# EAGLE design motherboard (EAGLE 6.5.0)
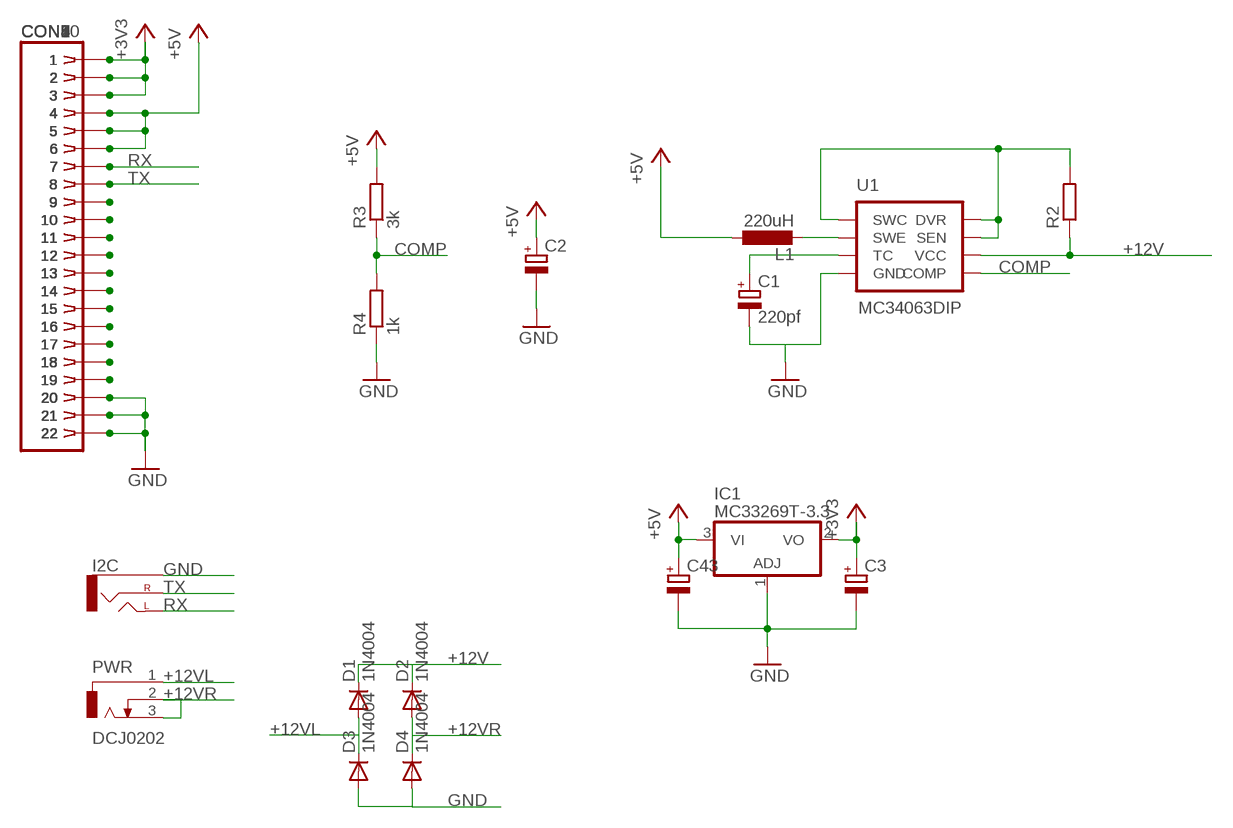
[diagram p0: schematic, sheet 1]

## Parts
C1  220pf  CPOL-EUE3.5-8  [E3,5-8]
C2  CPOL-EUE3.5-8  [E3,5-8]
C3  CPOL-EUE2-4  [E2-4]
C43  CPOL-EUE2-4  [E2-4]
CON1  SIMM22  [SIMM22]
CON2  SIMM22  [SIMM22]
CON3  SIMM22  [SIMM22]
CON4  SIMM22  [SIMM22]
CON5  SIMM22  [SIMM22]
CON6  SIMM22  [SIMM22]
CON7  SIMM22  [SIMM22]
CON8  SIMM22  [SIMM22]
CON9  SIMM22  [SIMM22]
CON10  SIMM22  [SIMM22]
D1  1N4004  [DO41-10]
D2  1N4004  [DO41-10]
D3  1N4004  [DO41-10]
D4  1N4004  [DO41-10]
I2C  AUDIO-JACKPTH  [AUDIO-JACK]
IC1  MC33269T-3.3  [TO220V]
L1  220uH  L-EU0204/7  [0204/7]
PWR  DCJ0202  [DCJ0202]
R2  R-EU_0204/7  [0204/7]
R3  3k  R-EU_0204/7  [0204/7]
R4  1k  R-EU_0204/7  [0204/7]
U1  MC34063DIP  [DIP-08]

## Nets
+3V3: C3.+ CON1.1 CON1.2 CON1.3 CON2.1 CON2.2 CON2.3 CON3.1 CON3.2 CON3.3 CON4.1 CON4.2 CON4.3 CON5.1 CON5.2 CON5.3 CON6.1 CON6.2 CON6.3 CON7.1 CON7.2 CON7.3 CON8.1 CON8.2 CON8.3 CON9.1 CON9.2 CON9.3 CON10.1 CON10.2 CON10.3 IC1.2(VO)
+5V: C2.+ C43.+ CON1.4 CON1.5 CON1.6 CON2.4 CON2.5 CON2.6 CON3.4 CON3.5 CON3.6 CON4.4 CON4.5 CON4.6 CON5.4 CON5.5 CON5.6 CON6.4 CON6.5 CON6.6 CON7.4 CON7.5 CON7.6 CON8.4 CON8.5 CON8.6 CON9.4 CON9.5 CON9.6 CON10.4 CON10.5 CON10.6 IC1.3(VI) L1.1 R3.2
+12V: D1.C D2.C R2.1 U1.6(VCC)
+12VL: D1.A D3.C PWR.1
+12VR: D2.A D4.C PWR.2 PWR.3
COMP: R3.1 R4.2 U1.5(COMP)
GND: C1.- C2.- C3.- C43.- CON1.20 CON1.21 CON1.22 CON2.20 CON2.21 CON2.22 CON3.20 CON3.21 CON3.22 CON4.20 CON4.21 CON4.22 CON5.20 CON5.21 CON5.22 CON6.20 CON6.21 CON6.22 CON7.20 CON7.21 CON7.22 CON8.20 CON8.21 CON8.22 CON9.20 CON9.21 CON9.22 CON10.20 CON10.21 CON10.22 D3.A D4.A I2C.SLEEVE IC1.1(ADJ) R4.1 U1.4(GND)
N$1: L1.2 U1.2(SWE)
N$2: R2.2 U1.1(SWC) U1.7(SEN) U1.8(DVR)
N$3: C1.+ U1.3(TC)
N$4: CON1.19 CON2.19 CON3.19 CON4.19 CON5.19 CON6.19 CON7.19 CON8.19 CON9.19 CON10.19
N$5: CON1.18 CON2.18 CON3.18 CON4.18 CON5.18 CON6.18 CON7.18 CON8.18 CON9.18 CON10.18
N$6: CON1.17 CON2.17 CON3.17 CON4.17 CON5.17 CON6.17 CON7.17 CON8.17 CON9.17 CON10.17
N$7: CON1.16 CON2.16 CON3.16 CON4.16 CON5.16 CON6.16 CON7.16 CON8.16 CON9.16 CON10.16
N$8: CON1.15 CON2.15 CON3.15 CON4.15 CON5.15 CON6.15 CON7.15 CON8.15 CON9.15 CON10.15
N$9: CON1.14 CON2.14 CON3.14 CON4.14 CON5.14 CON6.14 CON7.14 CON8.14 CON9.14 CON10.14
N$10: CON1.13 CON2.13 CON3.13 CON4.13 CON5.13 CON6.13 CON7.13 CON8.13 CON9.13 CON10.13
N$11: CON1.12 CON2.12 CON3.12 CON4.12 CON5.12 CON6.12 CON7.12 CON8.12 CON9.12 CON10.12
N$12: CON1.11 CON2.11 CON3.11 CON4.11 CON5.11 CON6.11 CON7.11 CON8.11 CON9.11 CON10.11
N$13: CON1.10 CON2.10 CON3.10 CON4.10 CON5.10 CON6.10 CON7.10 CON8.10 CON9.10 CON10.10
N$14: CON1.9 CON2.9 CON3.9 CON4.9 CON5.9 CON6.9 CON7.9 CON8.9 CON9.9 CON10.9
RX: CON1.7 CON2.7 CON3.7 CON4.7 CON5.7 CON6.7 CON7.7 CON8.7 CON9.7 CON10.7 I2C.TIP(LEFT)
TX: CON1.8 CON2.8 CON3.8 CON4.8 CON5.8 CON6.8 CON7.8 CON8.8 CON9.8 CON10.8 I2C.RING(RIGHT)

## Library data of the parts
C1-C3 C43 = rcl:CPOL-EU: POLARIZED CAPACITOR, European symbol
CON1-CON10 = con-amp:SIMM22: AMP connector
D1-D4 = adafruit:1N4004: DIODE General purpose 1N400x type rectifier (With bigger pads) http://www.ladyada.net/library/pcb/eaglelibrary.html
I2C = SparkFun-Connectors:AUDIO-JACK: 3.5mm Audio Jack Simple 3.5mm common PCB mount audio jack. SKU: PRT-08032
IC1 = linear:MC33269?*: Adjustable Output Low Dropout Voltage Regulator 800 mA Source: http://www.onsemi.com/pub/Collateral/MC33269-D.PDF
L1 = rcl:L-EU: INDUCTOR, European symbol
PWR = con-jack:DCJ0202: DC POWER JACK Source: DCJ0202.pdf; OC_FARNELL: unknown; OC_NEWARK: unknown
R2-R4 = rcl:R-EU_: RESISTOR, European symbol
U1 = SparkFun-PowerIC:MC34063: Jellybean switching supply controller

## Board
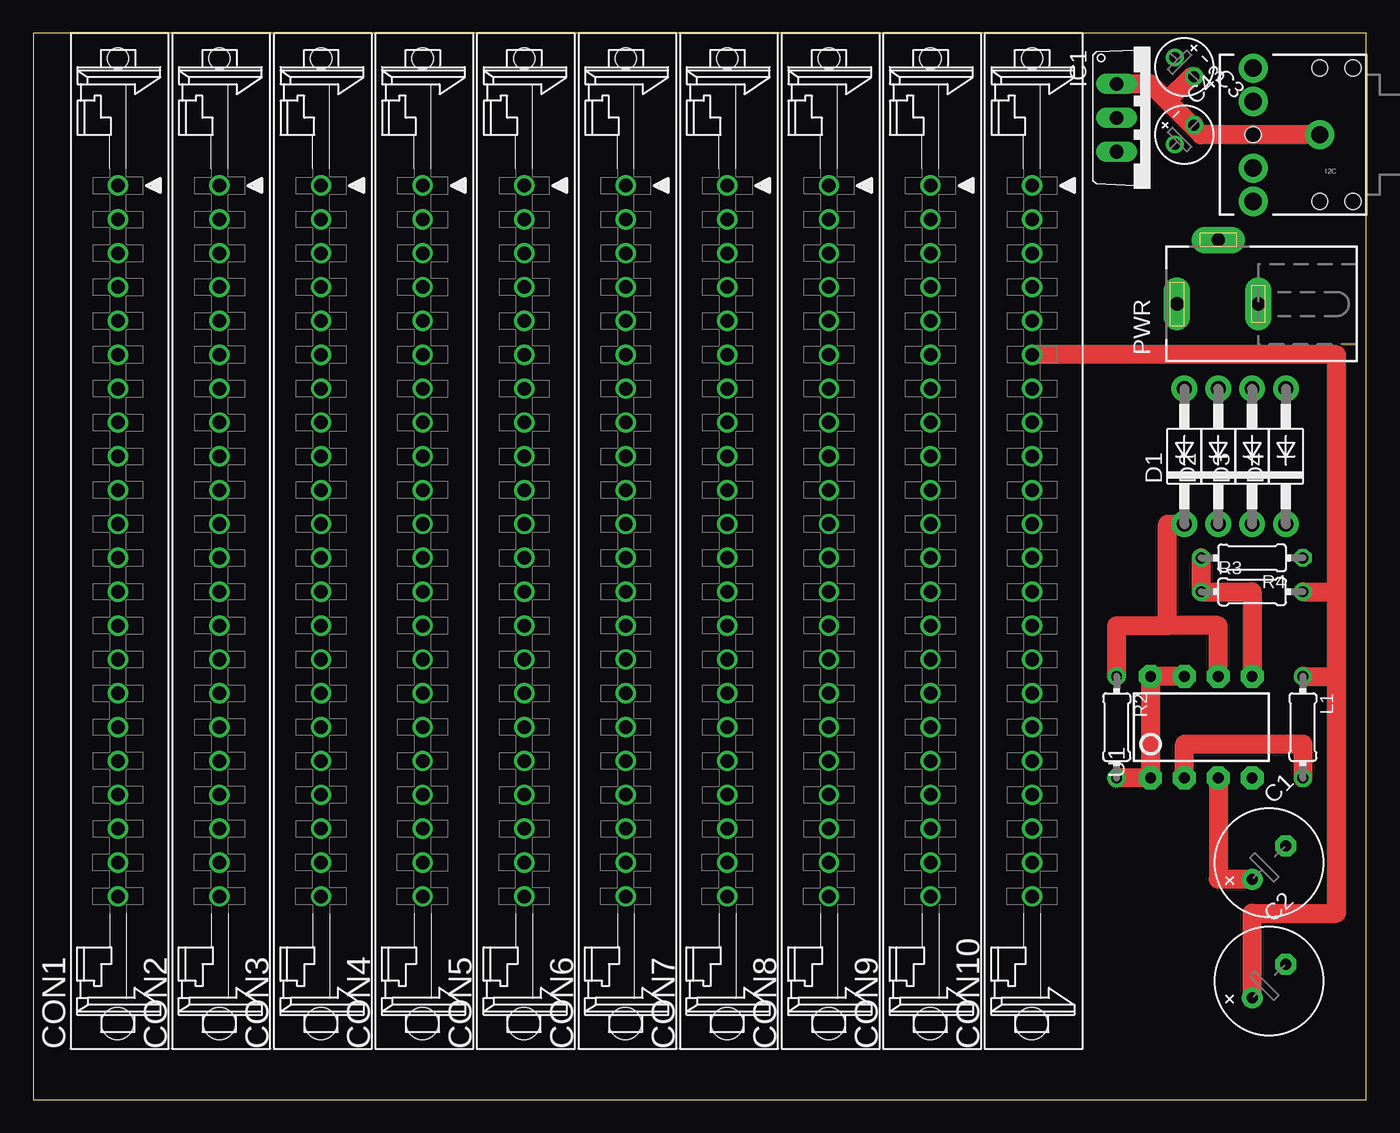
[diagram p1: board, top side]
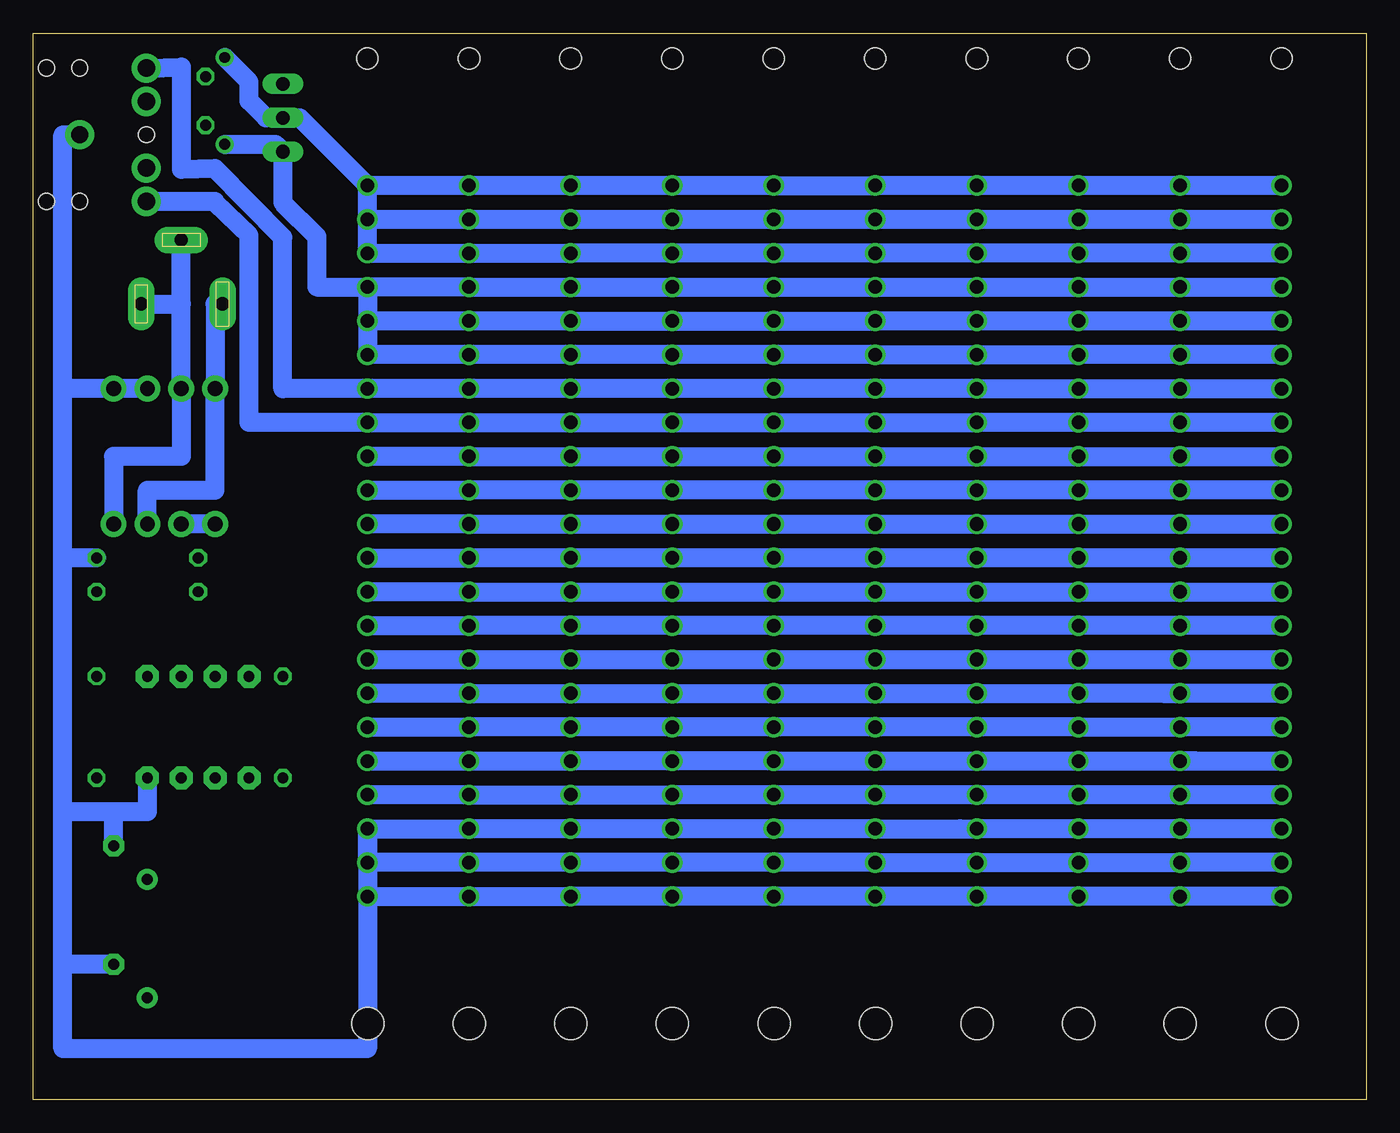
[diagram p2: board, bottom side, seen from below]

Size 100 x 80 mm. Coordinates in mm from the lower left corner, seen from the top.
Outline: 0,0 100,0 100,80 0,80 0,0
Copper layers (1*16): Top 0.035mm / dielectric 1.5mm / Bottom 0.035mm
Design rules "default": minimum track width 10mil, minimum drill 24mil, track to track 8mil, track to pad 8mil, pad to pad 8mil, via to via 8mil, smd to smd 8mil, copper to edge 40mil, drill to drill 8mil, minimum pad ring 10mil, minimum via ring 8mil, stop-mask expansion 4mil, vias tented up to drill 0mil, thermal gap 10mil

### Footprints (pad centres in the part's own frame; a part is rotated, then mirrored left to right if it is on the bottom)
E3,5-8 = drill 0.813 pad 1.6: + -1.778,0 | drill 0.813 pad 1.6 octagon: - 1.778,0
E2-4 = drill 0.813 pad 1.27: + -1.016,0 | drill 0.813 pad 1.27 octagon: - 1.016,0
SIMM22 = drill 1.016: 1 26.67,0; 2 24.13,0; 3 21.59,0; 4 19.05,0; 5 16.51,0; 6 13.97,0; 7 11.43,0; 8 8.89,0; 9 6.35,0; 10 3.81,0; 11 1.27,0; 12 -1.27,0; 13 -3.81,0; 14 -6.35,0; 15 -8.89,0; 16 -11.43,0; 17 -13.97,0; 18 -16.51,0; 19 -19.05,0; 20 -21.59,0; 21 -24.13,0; 22 -26.67,0 | hole 2.413: -36.22,0.025 | hole 1.6: 36.195,0
DO41-10 = drill 1.118 pad 1.93: A 5.08,0; C -5.08,0
AUDIO-JACK = drill 1.3 pad 2.184: RING 5,5; RSH 5,2.5; SLEEVE 0,0; TIP 5,-5; TSH 5,-2.5 | hole 1.2: 0,5; -2.5,5; -2.5,-5; 0,-5; 5,0
TO220V = drill 1.016 long: 1 -2.54,-2.54; 2 0,-2.54; 3 2.54,-2.54
0204/7 = drill 0.813 octagon: 1 -3.81,0; 2 3.81,0
DCJ0202 = drill 1 pad 2 long: 1 0,3.1; 2 4.8,0; 3 0,-3
DIP-08 = drill 0.813 pad 1.727 octagon: 1 -3.81,-3.81; 2 -1.27,-3.81; 3 1.27,-3.81; 4 3.81,-3.81; 5 3.81,3.81; 6 1.27,3.81; 7 -1.27,3.81; 8 -3.81,3.81

### Placement (x,y rotation side)
C1  92.71,17.78 45 top
C2  92.71,8.89 45 top
C3  86.36,77.47 315 top
C43  86.36,72.39 45 top
CON1  6.35,41.91 90 top
CON2  13.97,41.91 90 top
CON3  21.59,41.91 90 top
CON4  29.21,41.91 90 top
CON5  36.83,41.91 90 top
CON6  44.45,41.91 90 top
CON7  52.07,41.91 90 top
CON8  59.69,41.91 90 top
CON9  67.31,41.91 90 top
CON10  74.93,41.91 90 top
D1  86.36,48.26 90 top
D2  88.9,48.26 90 top
D3  91.44,48.26 90 top
D4  93.98,48.26 90 top
I2C  96.52,72.39 180 top
IC1  83.82,73.66 270 top
L1  95.25,27.94 270 top
PWR  88.9,59.69 90 top
R2  81.28,27.94 270 top
R3  91.44,38.1 0 top
R4  91.44,40.64 180 top
U1  87.63,27.94 0 top

### Tracks (layer width: path | path; a pad name or v marks a point on that pad's centre or on a via)
+3V3
  Bottom 1.422: CON1.1 CON2.1 CON3.1 CON4.1 CON5.1 CON6.1 CON7.1 CON8.1 CON9.1 CON10.1 | CON10.2 CON9.2 CON8.2 CON7.2 CON6.2 CON5.2 CON4.2 CON3.2 CON2.2 CON1.2 | CON1.3 CON2.3 CON3.3 CON4.3 CON5.3 CON6.3 CON7.3 CON8.3 CON9.3 CON10.3 CON10.2 | CON10.2 CON10.1 | CON10.1 80.01,73.66 IC1.2 82.55,73.66 83.82,74.93 83.82,76.37 C3.+
+5V
  Top 1.422: L1.1 97.79,31.75 | 97.79,31.75 97.79,38.1 | R3.2 97.79,38.1 | 97.79,38.1 97.79,55.88 CON10.6 | C2.+ 91.45,13.97 97.79,13.97 97.79,31.75
  Bottom 1.422: CON10.4 CON10.5 | CON10.5 CON10.6 CON9.6 CON8.6 CON7.6 CON6.6 CON5.6 CON4.6 CON3.6 CON2.6 CON1.6 | CON10.5 CON9.5 CON8.5 CON7.5 CON6.5 CON5.5 CON4.5 CON3.5 CON2.5 CON1.5 | CON10.4 CON9.4 CON8.4 CON7.4 CON6.4 CON5.4 CON4.4 CON3.4 CON2.4 CON1.4 | CON10.4 78.74,60.96 78.74,64.77 81.28,67.31 IC1.3 81.83,71.67 C43.+
+12V
  Top 1.422: U1.6 88.9,35.56 85.09,35.56 | 85.09,35.56 85.09,43.18 D1.C | R2.1 81.28,35.56 85.09,35.56
  Bottom 1.422: D1.C D2.C
+12VL
  Bottom 1.422: D3.C 91.44,45.72 86.36,45.72 D1.A 86.36,59.69 PWR.1
+12VR
  Bottom 1.422: D4.C 93.98,48.26 88.9,48.26 D2.A 88.9,59.69 | 88.9,59.69 PWR.2 | PWR.3 88.9,59.69
COMP
  Top 1.422: R4.2 R3.1 91.44,38.1 U1.5
GND
  Top 1.422: I2C.SLEEVE 87.63,72.39 87,73.03 | 87,73.03 85.09,74.93 | 85.09,74.93 83.82,76.2 IC1.1 | C3.- 86.91,76.75 85.09,74.93 | C43.- 87,73.03
  Bottom 1.422: D3.A D4.A 97.79,53.34 | CON10.22 CON9.22 CON8.22 CON7.22 CON6.22 CON5.22 CON4.22 CON3.22 CON2.22 CON1.22 | CON10.21 CON9.21 CON8.21 CON7.21 CON6.21 CON5.21 CON4.21 CON3.21 CON2.21 CON1.21 | CON10.21 CON10.22 | CON10.21 CON10.20 | CON10.20 CON9.20 CON8.20 CON7.20 CON6.20 CON5.20 CON4.20 | CON10.20 CON10.22 | CON10.22 74.93,3.81 97.79,3.81 97.79,10.15 | 97.79,10.15 97.79,21.59 | 97.79,21.59 97.79,40.64 | R4.1 97.79,40.64 | 97.79,40.64 97.79,53.34 | 97.79,53.34 97.79,72.39 I2C.SLEEVE | CON4.20 CON3.20 CON2.20 CON1.20 | 30.48,20.32 CON4.20 | U1.4 91.44,21.59 93.98,21.59 | 93.98,21.59 97.79,21.59 | C1.- 93.98,21.59 | C2.- 97.79,10.15
N$1
  Top 1.422: U1.2 86.36,26.67 95.25,26.67 L1.2
N$2
  Top 1.422: U1.7 U1.8 U1.1 R2.2
N$3
  Top 1.422: U1.3 88.9,16.52 C1.+
N$4
  Bottom 1.422: CON10.19 CON9.19 CON8.19 CON7.19 CON6.19 CON5.19 CON4.19 CON3.19 CON2.19 CON1.19
N$5
  Bottom 1.422: CON10.18 CON9.18 CON8.18 CON7.18 CON6.18 CON5.18 CON4.18 CON3.18 CON2.18 | 12.7,25.4 CON2.18 | CON2.18 CON1.18
N$6
  Bottom 1.422: CON1.17 CON2.17 CON3.17 CON4.17 CON5.17 CON6.17 CON7.17 CON8.17 CON9.17 CON10.17
N$7
  Bottom 1.422: CON1.16 CON2.16 | 15.24,30.48 CON2.16 | CON2.16 CON3.16 CON4.16 CON5.16 CON6.16 CON7.16 CON8.16 CON9.16 CON10.16
N$8
  Bottom 1.422: CON10.15 CON9.15 CON8.15 CON7.15 CON6.15 CON5.15 CON4.15 CON3.15 CON2.15 CON1.15
N$9
  Bottom 1.422: CON10.14 CON9.14 CON8.14 CON7.14 CON6.14 CON5.14 CON4.14 CON3.14 CON2.14 CON1.14
N$10
  Bottom 1.422: CON10.13 CON9.13 CON8.13 CON7.13 CON6.13 CON5.13 CON4.13 CON3.13 CON2.13 CON1.13
N$11
  Bottom 1.422: CON10.12 CON9.12 CON8.12 CON7.12 CON6.12 CON5.12 CON4.12 CON3.12 CON2.12 CON1.12
N$12
  Bottom 1.422: CON10.11 CON9.11 CON8.11 CON7.11 CON6.11 CON5.11 CON4.11 CON3.11 CON2.11 CON1.11
N$13
  Bottom 1.422: CON10.10 CON9.10 CON8.10 CON7.10 CON6.10 CON5.10 CON4.10 CON3.10 CON2.10 CON1.10
N$14
  Bottom 1.422: CON10.9 CON9.9 CON8.9 CON7.9 CON6.9 CON5.9 CON4.9 CON3.9 CON2.9 CON1.9
RX
  Bottom 1.422: CON1.7 CON2.7 CON3.7 CON4.7 CON5.7 CON6.7 CON7.7 CON8.7 CON9.7 CON10.7 81.28,53.34 81.28,64.69 86.36,69.85 88.9,69.77 88.9,77.47 I2C.TIP
TX
  Bottom 1.422: CON1.8 CON2.8 CON3.8 CON4.8 CON5.8 CON6.8 CON7.8 CON8.8 CON9.8 CON10.8 83.82,50.8 83.82,64.85 86.36,67.31 86.36,67.39 I2C.RING